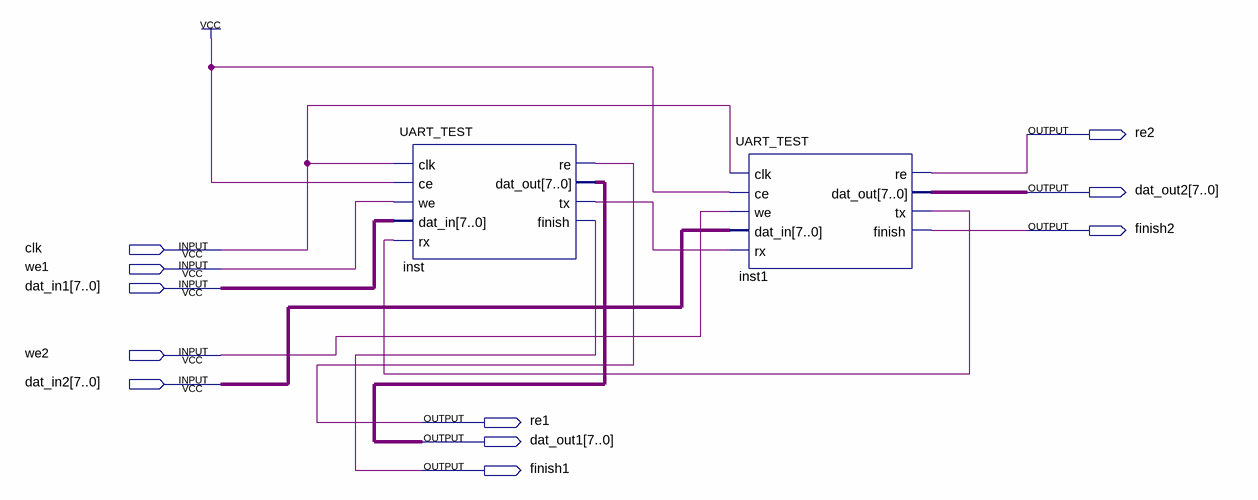
[diagram p0: schematic sheet]
// Quartus schematic TEST.bdf as structural Verilog: 2 symbols, 11 pins
module TEST (
  input  clk,
  input  we1,
  input  [7:0] dat_in1,
  input  we2,
  input  [7:0] dat_in2,
  output re2,
  output [7:0] dat_out2,
  output finish2,
  output re1,
  output [7:0] dat_out1,
  output finish1
);

  wire inst1_tx, inst_tx;

  UART_TEST inst (
    .clk(clk), .ce(1'b1), .we(we1), .dat_in(dat_in1), .rx(inst1_tx), .re(re1), .dat_out(dat_out1),
    .tx(inst_tx), .finish(finish1));
  UART_TEST inst1 (
    .clk(clk), .ce(1'b1), .we(we2), .dat_in(dat_in2), .rx(inst_tx), .re(re2), .dat_out(dat_out2),
    .tx(inst1_tx), .finish(finish2));
endmodule
